# EAGLE design Legacy MkII (EAGLE 9.6.0)

## Sheet 1 of 3: Block Diagram
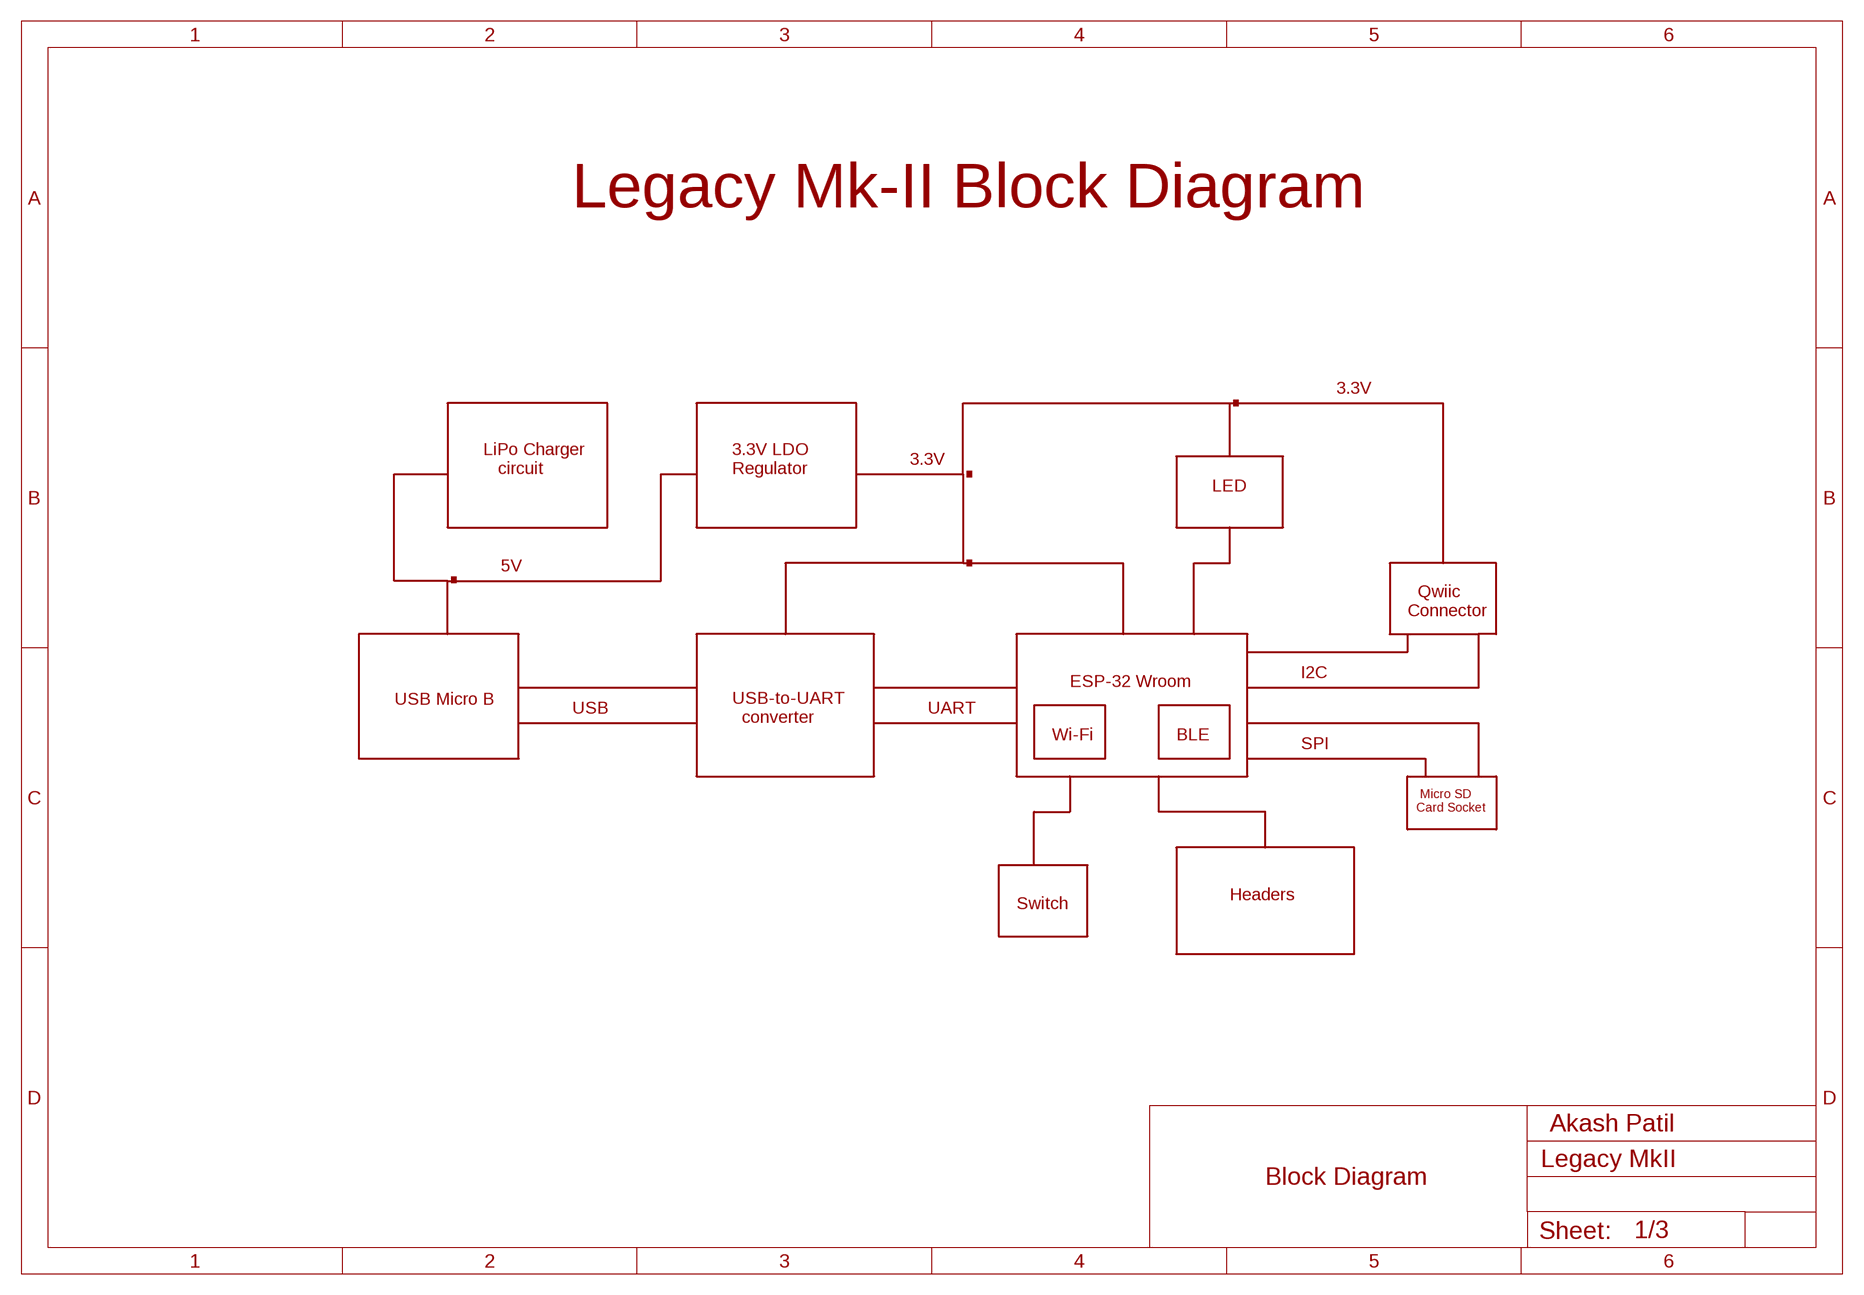
[diagram p0: schematic, sheet 1]

### Notes on the sheet
- Legacy Mk-II Block Diagram
- 3.3V
- .
- 3.3V
- LiPo Charger
     circuit
- 3.3V LDO
  Regulator
- .
- LED
- .
- 5V
- .
- Qwiic
  Connector
- I2C
- ESP-32 Wroom
- USB Micro B
- USB | UART
- USB-to-UART
    converter
- Wi-Fi | BLE
- SPI
- Micro SD 
  Card Socket
- Headers
- Switch
- Akash Patil
- Block Diagram

## Sheet 2 of 3: USB to UART converter, LDO regulator and Li-Po charger circuit.
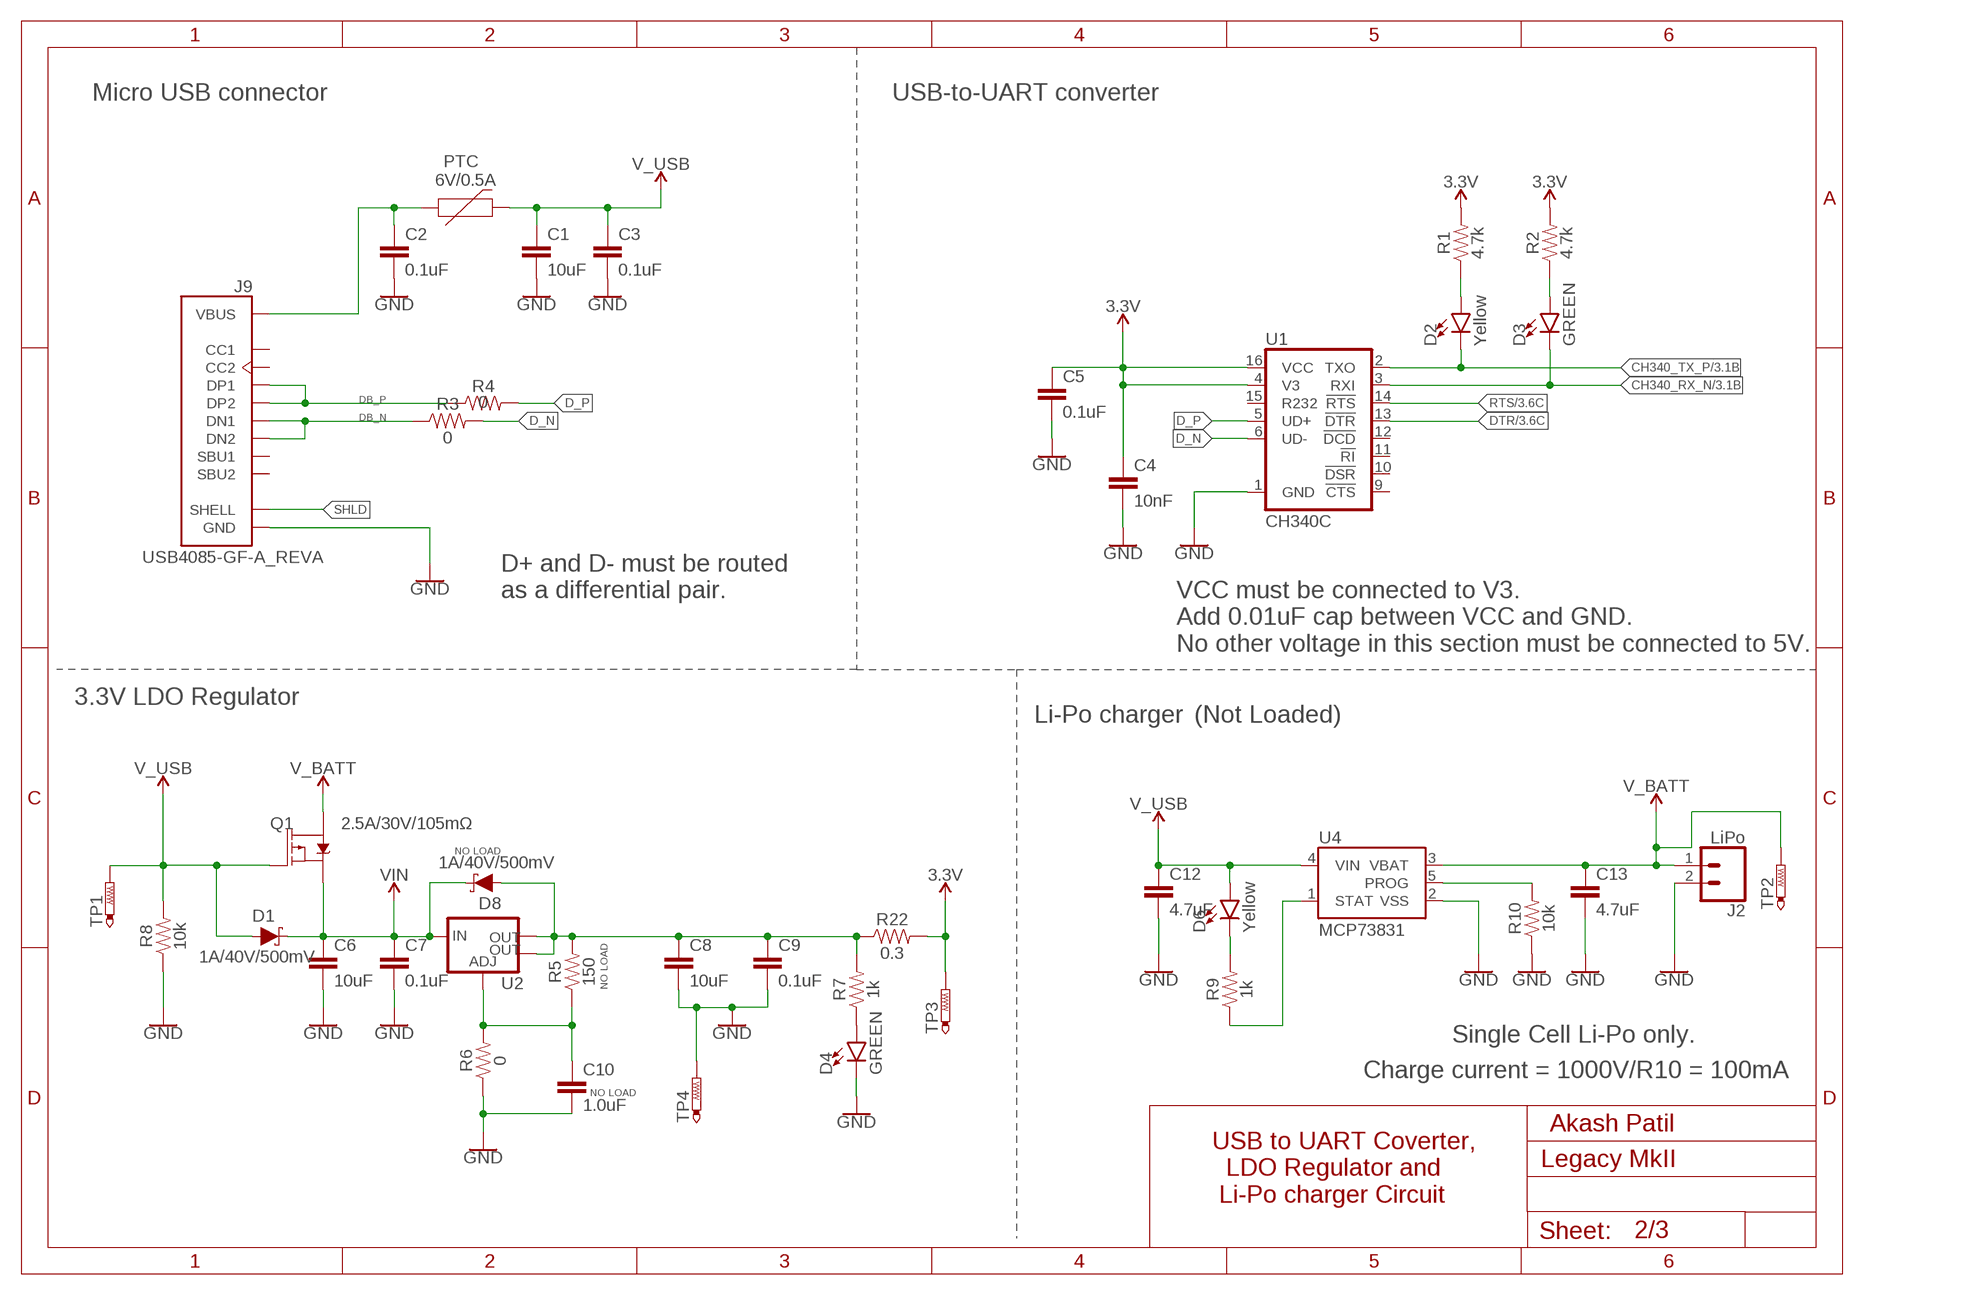
[diagram p1: schematic, sheet 2]

### Parts
C1  10uF  10UF-1210-50V-20%  [1210]
C2  0.1uF  0.1UF-0603-25V-(+80/-20%)  [0603]
C3  0.1uF  0.1UF-0603-25V-(+80/-20%)  [0603]
C4  10nF  10NF-0603-50V-10%  [0603]
C5  0.1uF  0.1UF-0603-25V-5%  [0603]
C6  10uF  10UF-1210-50V-20%  [1210]
C7  0.1uF  0.1UF-0603-25V-5%  [0603]
C8  10uF  10UF-1210-50V-20%  [1210]
C9  0.1uF  0.1UF-0603-25V-5%  [0603]
C10  1.0uF  1.0UF-0603-16V-10%  [0603]
C12  4.7uF  4.7UF-1206-16V-(+80/-20%)  [1206]
C13  4.7uF  4.7UF-1206-16V-(+80/-20%)  [1206]
D1  1A/40V/500mV  DIODE-SCHOTTKY-SS14  [SMA-DIODE]
D2  Yellow  LED-YELLOW0603  [LED-0603]
D3  GREEN  LED-GREEN0603  [LED-0603]
D4  GREEN  LED-GREEN0603  [LED-0603]
D6  Yellow  LED-YELLOW0603  [LED-0603]
D8  1A/40V/500mV  DIODE-SCHOTTKY-SS14  [SMA-DIODE]
J2  LiPo  CONN_02-JST-2-PTH-NO_SILK  [JST-2-PTH-NS]
J9  USB4085-GF-A_REVA  [GCT_USB4085-GF-A_REVA]
PTC  6V/0.5A  PPTC_6V500MA-2  [1206]
Q1  2.5A/30V/105mΩ  MOSFET_PCH-DMG2307L  [SOT23-3]
R1  4.7k  4.7KOHM-0603-1/10W-1%  [0603]
R2  4.7k  4.7KOHM-0603-1/10W-1%  [0603]
R3  0  0OHM-0603-1/10W-5%  [0603]
R4  0  0OHM-0603-1/10W-5%  [0603]
R5  150  150OHM-0603-1/10W-1%  [0603]
R6  0  0OHM-0603-1/10W-5%  [0603]
R7  1k  1KOHM-0603-1/10W-1%  [0603]
R8  10k  10KOHM-0603-1/10W-1%  [0603]
R9  1k  1KOHM-0603-1/10W-1%  [0603]
R10  10k  10KOHM-0603-1/10W-1%  [0603]
R22  0.3  0.3OHM-0805-1/8W-1%  [0805]
TP1  PTR1B1,27  [B1,27]
TP2  PTR1B1,27  [B1,27]
TP3  PTR1B1,27  [B1,27]
TP4  PTR1B1,27  [B1,27]
U1  CH340C  [SO016]
U2  V_REG_LM1117SOT223  [SOT223]
U4  MCP73831  [SOT23-5]

### Nets
3.3V: C4.1 C5.1 R1.2 R2.2 R22.2 TP3.TP U1.4(V3) U1.16(VCC) ; also sheet 3
CH340_RX_N: D3.C U1.3(RXI) ; also sheet 3
CH340_TX_P: D2.C U1.2(TXO) ; also sheet 3
D_N: R3.2 U1.6(UD-)
D_P: R4.2 U1.5(UD+)
DB_N: J9.A7(DN1) J9.B7(DN2) R3.1
DB_P: J9.A6(DP1) J9.B6(DP2) R4.1
DTR: U1.13(!DTR) ; also sheet 3
GND: C1.2 C2.2 C3.2 C4.2 C5.2 C6.2 C7.2 C8.2 C9.2 C10.2 C12.2 C13.2 D4.C J2.2 J9.A1(GND) J9.A12(GND) J9.B1(GND) J9.B12(GND) R6.1 R8.1 R10.1 TP4.TP U1.1(GND) U4.2(VSS) ; also sheet 3
N$1: C2.1 J9.A4(VBUS) J9.A9(VBUS) J9.B4(VBUS) J9.B9(VBUS) PTC.1
N$3: D4.A R7.1
N$4: C8.1 C9.1 D8.A R5.2 R7.2 R22.1 U2.2(OUT) U2.4(OUT)
N$5: D2.A R1.1
N$7: D3.A R2.1
N$11: C10.1 R5.1 R6.2 U2.1(ADJ)
N$12: D6.C R9.2
N$13: R9.1 U4.1(STAT)
N$15: R10.2 U4.5(PROG)
RTS: U1.14(!RTS) ; also sheet 3
SHLD: J9.P1(SHELL) J9.P2(SHELL) J9.P3(SHELL) J9.P4(SHELL)
V_BATT: C13.1 J2.1 Q1.3(D) TP2.TP U4.3(VBAT)
V_USB: C1.1 C3.1 C12.1 D1.A D6.A PTC.2 Q1.1(G) R8.2 TP1.TP U4.4(VIN) ; also sheet 3
VIN: C6.1 C7.1 D1.C D8.C Q1.2(S) U2.3(IN) ; also sheet 3
Unconnected: J9.A5(CC1) J9.A8(SBU1) J9.B5(CC2) J9.B8(SBU2) U1.9(!CTS) U1.10(!DSR) U1.11(!RI) U1.12(!DCD) U1.15(R232)

### Notes on the sheet
- Micro USB connector | USB-to-UART converter
- D+ and D- must be routed
  as a differential pair.
- VCC must be connected to V3. 
  Add 0.01uF cap between VCC and GND.
  No other voltage in this section must be connected to 5V.
- 3.3V LDO Regulator
- Li-Po charger | (Not Loaded)
- Single Cell Li-Po only.
- Charge current = 1000V/R10 = 100mA
- Akash Patil
- USB to UART Coverter,
    LDO Regulator and 
   Li-Po charger Circuit

## Sheet 3 of 3: ESP-32, Auto reset and switches circuit.
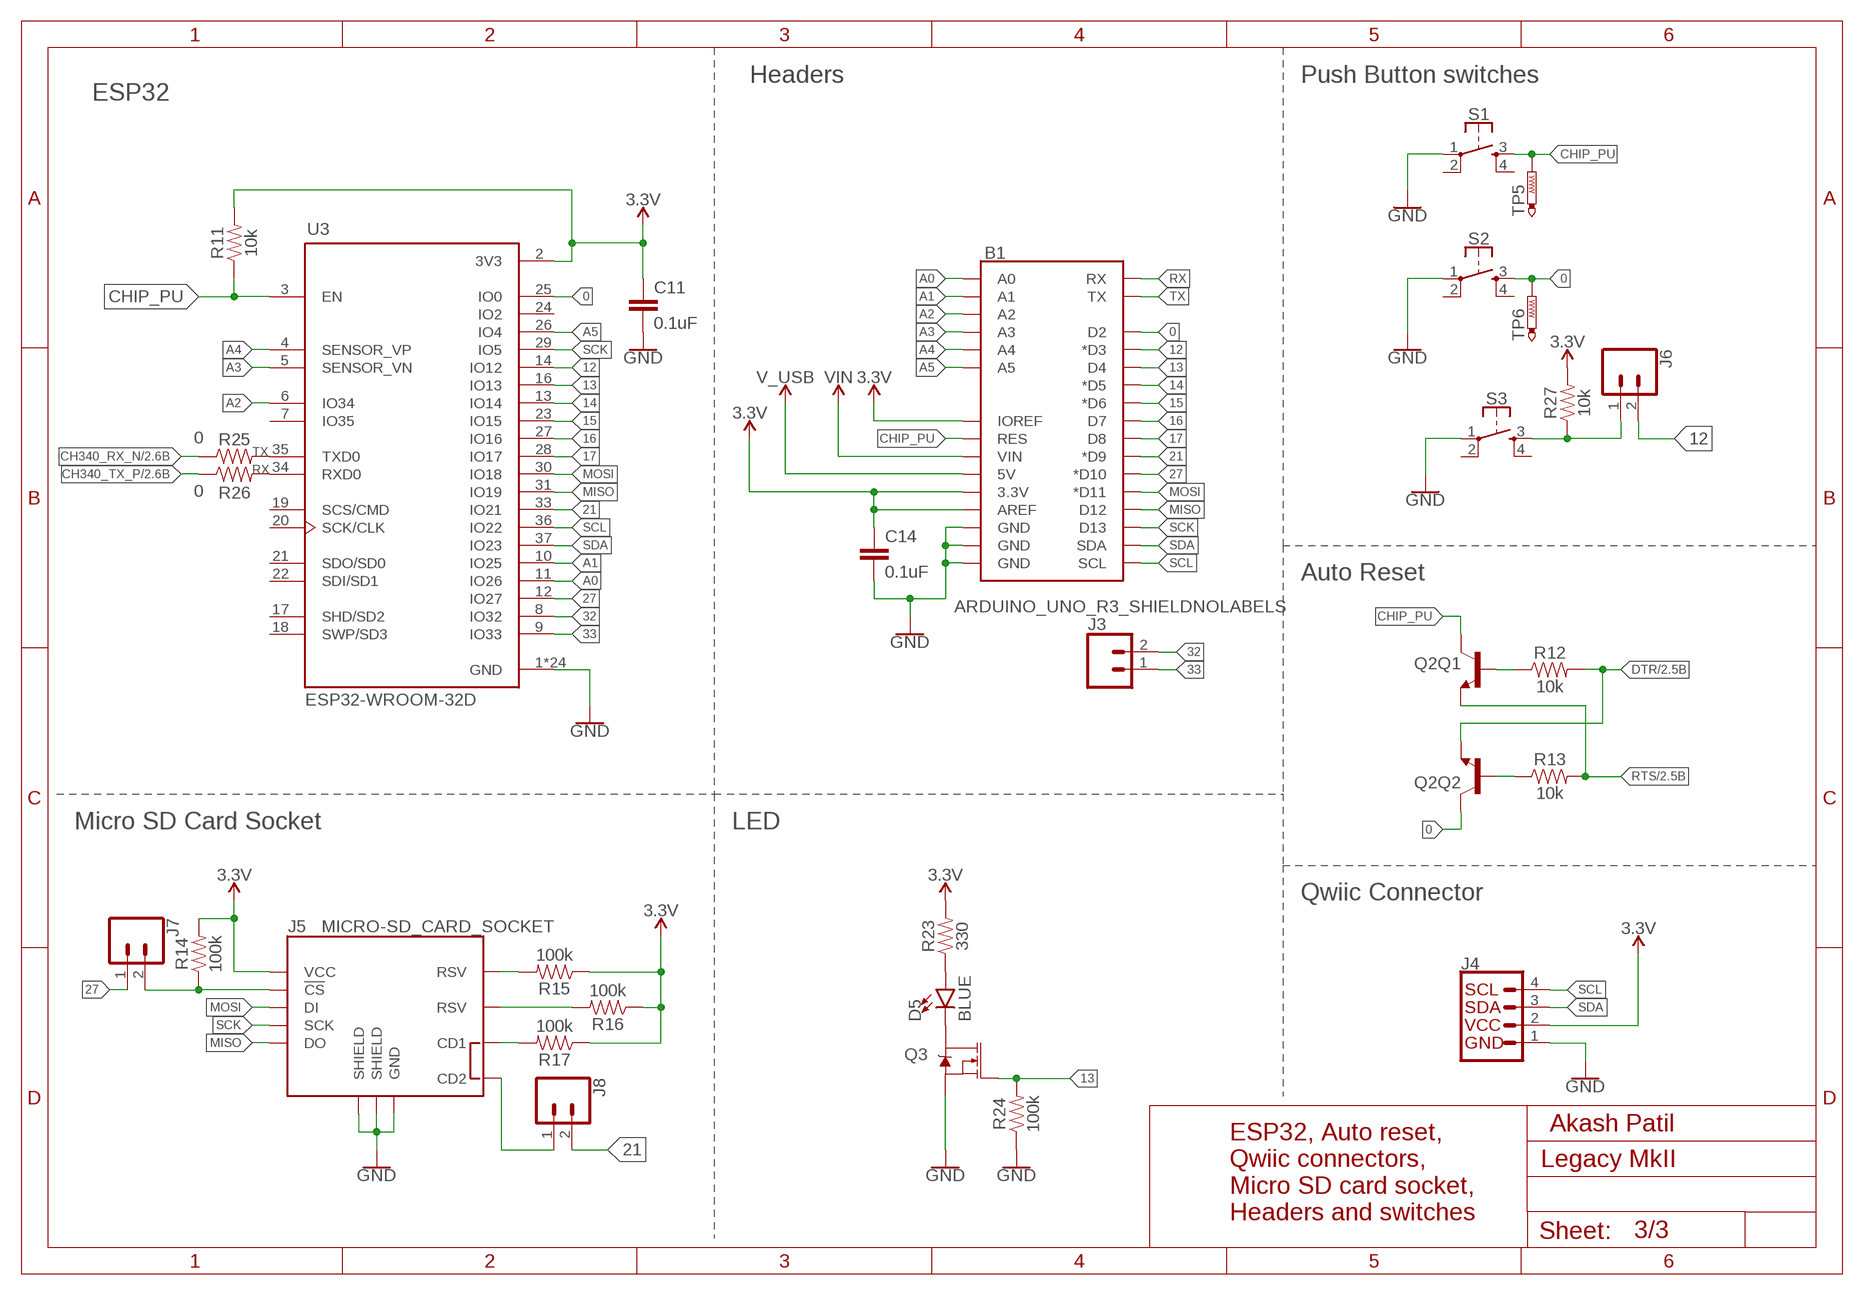
[diagram p2: schematic, sheet 3]

### Parts
B1  ARDUINO_UNO_R3_SHIELDNOLABELS  [UNO_R3_SHIELD_NOLABELS]
C11  0.1uF  0.1UF-0603-25V-5%  [0603]
C14  0.1uF  0.1UF-0603-25V-5%  [0603]
D5  BLUE  LED-BLUE0603  [LED-0603]
J3  CONN_021X02_NO_SILK  [1X02_NO_SILK]
J4  QWIIC_CONNECTORJS-1MM  [1X04_1MM_RA]
J5  MICRO-SD_CARD_SOCKET  [MICRO-SD-SOCKET]
J6  CONN_02  [1X02]
J7  CONN_02  [1X02]
J8  CONN_02  [1X02]
Q2  TRANS_NPN_DUAL-MBT3904DW1T1  [SC70-6]
Q3  220mA/50V/3.5Ω  MOSFET-NCH-BSS138  [SOT23-3]
R11  10k  10KOHM-0603-1/10W-1%  [0603]
R12  10k  10KOHM-0603-1/10W-1%  [0603]
R13  10k  10KOHM-0603-1/10W-1%  [0603]
R14  100k  100KOHM-0603-1/10W-1%  [0603]
R15  100k  100KOHM-0603-1/10W-1%  [0603]
R16  100k  100KOHM-0603-1/10W-1%  [0603]
R17  100k  100KOHM-0603-1/10W-1%  [0603]
R23  330  330OHM-0603-1/10W-1%  [0603]
R24  100k  100KOHM-0603-1/10W-1%  [0603]
R25  0  0OHM-0603-1/10W-5%  [0603]
R26  0  0OHM-0603-1/10W-5%  [0603]
R27  10k  10KOHM-0603-1/10W-1%  [0603]
S1  MOMENTARY-SWITCH-SPST-2-SMD-4.6X2.8MM  [TACTILE_SWITCH_SMD_4.6X2.8MM]
S2  MOMENTARY-SWITCH-SPST-2-SMD-4.6X2.8MM  [TACTILE_SWITCH_SMD_4.6X2.8MM]
S3  MOMENTARY-SWITCH-SPST-2-SMD-4.6X2.8MM  [TACTILE_SWITCH_SMD_4.6X2.8MM]
TP5  PTR1B1,27  [B1,27]
TP6  PTR1B1,27  [B1,27]
U3  ESP32-WROOM-32D  [MODULE_ESP32-WROOM-32D]

### Nets
0: B1.D2 Q2.6(Q2:C) S2.3 TP6.TP U3.25(IO0)
3.3V: B1.3.3V B1.AREF B1.IOREF C11.1 C14.1 J4.2(VCC) J5.VCC R11.2 R14.2 R15.1 R16.1 R17.1 R23.2 R27.2 U3.2(3V3) ; also sheet 2
12: B1.D3(*D3) J6.2 U3.14(IO12)
13: B1.D4 Q3.1(G) R24.2 U3.16(IO13)
14: B1.D5(*D5) U3.13(IO14)
15: B1.D6(*D6) U3.23(IO15)
16: B1.D7 U3.27(IO16)
17: B1.D8 U3.28(IO17)
21: B1.D9(*D9) J8.2 U3.33(IO21)
27: B1.D10(*D10) J7.1 U3.12(IO27)
32: J3.2 U3.8(IO32)
33: J3.1 U3.9(IO33)
A0: B1.A0 U3.11(IO26)
A1: B1.A1 U3.10(IO25)
A2: B1.A2 U3.6(IO34)
A3: B1.A3 U3.5(SENSOR_VN)
A4: B1.A4 U3.4(SENSOR_VP)
A5: B1.A5 U3.26(IO4)
CH340_RX_N: R25.1 ; also sheet 2
CH340_TX_P: R26.1 ; also sheet 2
CHIP_PU: B1.RES Q2.3(Q1:C) R11.1 S1.3 TP5.TP U3.3(EN)
DTR: Q2.1(Q2:E) R12.2 ; also sheet 2
GND: B1.GND@0(GND) B1.GND@1(GND) B1.GND@2(GND) C11.2 C14.2 J4.1(GND) J5.GND J5.GND1(SHIELD) J5.GND3(SHIELD) Q3.2(S) R24.1 S1.1 S2.1 S3.1 U3.1(GND) U3.15(GND) U3.38(GND) U3.39_1(GND) U3.39_2(GND) U3.39_3(GND) U3.39_4(GND) U3.39_5(GND) U3.39_6(GND) U3.39_7(GND) U3.39_8(GND) U3.39_9(GND) U3.39_10(GND) U3.39_11(GND) U3.39_12(GND) U3.39_13(GND) U3.39_14(GND) U3.39_15(GND) U3.39_16(GND) U3.39_17(GND) U3.39_18(GND) U3.39_19(GND) U3.39_20(GND) U3.39_21(GND) ; also sheet 2
MISO: B1.D12 J5.DO U3.31(IO19)
MOSI: B1.D11(*D11) J5.DI U3.30(IO18)
N$2: J5.CD2 J8.1
N$6: J5.CS(!CS) J7.2 R14.1
N$8: D5.A R23.1
N$14: Q2.5(Q1:B) R12.1
N$16: Q2.2(Q2:B) R13.1
N$19: J5.RSV1(RSV) R15.2
N$22: D5.C Q3.3(D)
N$23: J5.RSV2(RSV) R16.2
N$24: J5.CD1 R17.2
N$25: J6.1 R27.1 S3.3
RTS: Q2.4(Q1:E) R13.2 ; also sheet 2
RX: B1.RX R26.2 U3.34(RXD0)
SCK: B1.D13 J5.SCLK(SCK) U3.29(IO5)
SCL: B1.SCL J4.4(SCL) U3.36(IO22)
SDA: B1.SDA J4.3(SDA) U3.37(IO23)
TX: B1.TX R25.2 U3.35(TXD0)
V_USB: B1.5V ; also sheet 2
VIN: B1.VIN ; also sheet 2
Unconnected: S1.2 S1.4 S2.2 S2.4 S3.2 S3.4 U3.7(IO35) U3.17(SHD/SD2) U3.18(SWP/SD3) U3.19(SCS/CMD) U3.20(SCK/CLK) U3.21(SDO/SD0) U3.22(SDI/SD1) U3.24(IO2)

### Notes on the sheet
- Headers | Push Button switches
- ESP32
- Auto Reset
- Micro SD Card Socket | LED
- Qwiic Connector
- Akash Patil
- ESP32, Auto reset, 
  Qwiic connectors, 
  Micro SD card socket, 
  Headers and switches

## Library data of the parts
B1 = SparkFun-Boards:ARDUINO_UNO_R3_SHIELD: Arduino R3 Shield Footprint Shield form compatible with the Arduino Uno R3. SparkFun Products: MG2639 Cellular Shield <https://www.sparkfun.com/products/13120> MIDI Shield <https://www.sparkfun.com/products/12898> R3 Stackable Headers Kit <https://www.sparkfun.com/products/11417>
C1 C6 C8 = SparkFun-Capacitors:10UF: 10.0µF ceramic capacitors A capacitor is a passive two-terminal electrical component used to store electrical energy temporarily in an electric field.; PROD_ID: CAP-09824
C2 C3 = SparkFun-Capacitors:0.1UF: 0.1µF ceramic capacitors A capacitor is a passive two-terminal electrical component used to store electrical energy temporarily in an electric field.; PROD_ID: CAP-00810
C4 = SparkFun-Capacitors:10NF: 0.01uF/10nF/10,000pF ceramic capacitors A capacitor is a passive two-terminal electrical component used to store electrical energy temporarily in an electric field. CAP-09321; PROD_ID: CAP-00867
C5 C7 C9 C11 C14 = SparkFun-Capacitors:0.1UF: 0.1µF ceramic capacitors A capacitor is a passive two-terminal electrical component used to store electrical energy temporarily in an electric field.; PROD_ID: CAP-08604
C10 = SparkFun-Capacitors:1.0UF: 1µF ceramic capacitors A capacitor is a passive two-terminal electrical component used to store electrical energy temporarily in an electric field.; LOADING: NO LOAD; PROD_ID: CAP-00868
C12 C13 = SparkFun-Capacitors:4.7UF: 4.7µF ceramic capacitors A capacitor is a passive two-terminal electrical component used to store electrical energy temporarily in an electric field.; PROD_ID: CAP-10300
D1 = SparkFun-DiscreteSemi:DIODE-SCHOTTKY: Schottky diode A Schottky diode is a semiconductor diode which has a low forward voltage drop and a very fast switching action.; PROD_ID: DIO-08053
D2 D6 = SparkFun-LED:LED-YELLOW: Yellow SMD LED Used in manufacturing several products at SparkFun. Packages: 0603 - SMD 0603 package[Product Link] <http://www.kingbrightusa.com/product.asp?catalog_name=LED&product_id=APT1608SYCK> 0603 -SMART - SMART SMD 0603 package (more efficient/more expensive) [Product Link] <http://www.osram-os.com/osram_os/en/products/product-catalog/led-light-emitting-diodes/smartled-0603/ly-l29k/index.jsp> LilyPad - SMD1206 package[Product Datasheet] <https://www.sparkfun.com/datasheets/DevTools/LilyPad/Q150YUS4.pdf> SparkFun Products: Blynk Board <https://www.sparkfun.com/products/13794> IOIO-OTG <https://www.sparkfun.com/products/13613> XBee Explorer Serial <https://www.sparkfun.com/products/13225>; PROD_ID: DIO-09003
D3 D4 = SparkFun-LED:LED-GREEN: Green SMD LED Used in manufacturing of various products at SparkFun Packages: 0603 - SMD 0603 package [Product Link] <http://www.futureelectronics.com/en/technologies/semiconductors/optoelectronics/leds/Pages/9894312-LTST-C190GKT.aspx?CrossPart=HSMG-C190&IM=0> LilyPad 1206 - SMD1206 LilyPad package [Product Link] <http://www.futureelectronics.com/en/Technologies/Product.aspx?ProductID=IN150NGHARVATEKCORPORATION2049943&IM=0> 1206 - SMD1206 package [Product Link] <http://www.futureelectronics.com/en/technologies/semiconductors/optoelectronics/leds/Pages/8315665-LTST-C150KGKT.aspx?IM=0> 1206 Bottom Mount -SMD 1206 Bottom Mount [Product Link] <http://www.digikey.com/product-detail/en/lite-on-inc/LTST-C230KGKT/160-1456-1-ND/386854> SparkFun Products: Pro Mini 328 -5V <https://www.sparkfun.com/products/821> RedBoard <https://www.sparkfun.com/products/12757> MP3 Trigger <https://www.sparkfun.com/products/13720> Makey Makey <https://www.sparkfun.com/products/11076>; PROD_ID: DIO-00821
D5 = SparkFun-LED:LED-BLUE: Blue SMD LED Used in manufacturing of various products at SparkFun Packages: 0603 - SMD 0603 package [Product Link] <http://www.digikey.com/product-detail/en/SMLE12BC7TT86/511-1589-2-ND/1641808> 1206 - SMD1206 package [Product Link] <http://www.digikey.com/product-detail/en/lite-on-inc/LTST-C150TBKT/160-1643-1-ND/573584> SparkFun Products: ESP8266 Thing-Dev Board <https://www.sparkfun.com/products/13711> RedBoard <https://www.sparkfun.com/products/12757>; PROD_ID: DIO-08575
D8 = SparkFun-DiscreteSemi:DIODE-SCHOTTKY: Schottky diode A Schottky diode is a semiconductor diode which has a low forward voltage drop and a very fast switching action.; LOADING: NO LOAD; PROD_ID: DIO-08053
J2 J3 J6-J8 = SparkFun-Connectors:CONN_02: Multi connection point. Often used as Generic Header-pin footprint for 0.1 inch spaced/style header connections On any of the 0.1 inch spaced packages, you can populate with these: Break Away Headers - Straight <https://www.sparkfun.com/products/116> (PRT-00116) Break Away Male Headers - Right Angle <https://www.sparkfun.com/products/553> (PRT-00553) Female Headers <https://www.sparkfun.com/products/115> (PRT-00115) Break Away Headers - Machine Pin <https://www.sparkfun.com/products/117> (PRT-00117) Break Away Female Headers - Swiss Machine Pin <https://www.sparkfun.com/products/743> (PRT-00743) For SCREWTERMINALS and SPRING TERMINALS visit here: Screw Terimnals on SparkFun.com <https://www.sparkfun.com/search/results?term=Screw+Terminals> (5mm/3.5mm/2.54mm spacing) This device is also useful as a general connection point to wire up your design to another part of your project. Our various solder wires solder well into these plated through hole pads. Hook-Up Wire - Assortment (Stranded, 22 AWG) <https://www.sparkfun.com/products/11375> (PRT-11375) Hook-Up Wire - Assortment (Solid Core, 22 AWG) <https://www.sparkfun.com/products/11367> (PRT-11367) View the entire wire category on our website here <https://www.sparkfun.com/categories/141> Special notes: Molex polarized connector foot print use with: PRT-08233 with associated crimp pins and housings. 2.54_SCREWTERM for use with PRT-10571. 3.5mm Screw Terminal footprints for PRT-08084 5mm Screw Terminal footprints for use with PRT-08432
J4 = SparkFun-Connectors:QWIIC_CONNECTOR: SparkFun I2C Standard Qwiic Connector An SMD 1mm pitch JST connector makes it easy and quick (get it? Qwiic?) to connect I2C devices to each other. The Qwiic system <http://www.sparkfun.com/qwiic> enables fast and solderless connection between popular platforms and various sensors and actuators. We carry 200mm <https://www.sparkfun.com/products/14204>, 100mm <https://www.sparkfun.com/products/14205>, 50mm <https://www.sparkfun.com/products/14206>, and breadboard friendly <https://www.sparkfun.com/products/14207> Qwiic cables. We also offer 10 pcs strips <https://www.sparkfun.com/products/14323> the SMD connectors.
J5 = SparkFun-Connectors:MICRO-SD_CARD_SOCKET: microSD Socket for Transflash Push-push type µSD socket. tDoc lines correctly indicate media card edge positions when inserting (unlocked, locked, depressed). NOTE: CD1 and CD2 are connected internally, and the default detect state of the socket is detect pin to ground. SparkFun Products: WAV Trigger <https://www.sparkfun.com/products/13660> CAN-Bus Shield <https://www.sparkfun.com/products/13262> SparkFun Level Shifing microSD Breakout <https://www.sparkfun.com/products/13743>; PROD_ID: CONN-07820; SF_ID: PRT-00127
J9 = USB4085-GF-A_REVA:USB4085-GF-A_REVA: USB 2.0 Type C Receptacle Dip Type, PCB Top Mount Check prices <https://pricing.snapeda.com/parts/USB4085-GF-A/Global%20Connector%20Technology/view-part?ref=eda>; AVAILABILITY: Warning; DESCRIPTION: USB-C (USB TYPE-C) USB 2.0 Receptacle Connector 24 (16+8 Dummy) Position Through Hole, Right Angle; MF: Global Connector Technology; MP: USB4085-GF-A; PACKAGE: Package; PRICE: None; PURCHASE-URL: https://pricing.snapeda.com/search/part/USB4085-GF-A/?ref=eda
PTC = SparkFun-Fuses:PPTC: Resettable Fuse PPTC Resettable Fuse. Really a sort of resistor with a polymeric positive temperature coefficient whose resistance increases dramatically with an increase in temperature. When heated by the power passing through the resistance rises causing the current to be limited, protecting the circuit. This is achieved by the transition of the polymer from a crystalline to an amorphous state where the conductive carbon separates breaking the conductive pathways found in the cool crystalline structure. When a PPTC cools back down it resumes conducting letting the circuit turn back on. SparkFun Products: SparkFun RedBoard - Programmed with Arduino <https://www.sparkfun.com/products/12757> Pro Micro - 5V/16MHz <https://www.sparkfun.com/products/12640> Arduino Pro 328 - 5V/16MHz <https://www.sparkfun.com/products/10915> MP3 Trigger <https://www.sparkfun.com/products/13720>; PROD_ID: RES-08585
Q1 = SparkFun-DiscreteSemi:MOSFET_PCH: P-channel MOSFETs Voltage controlled devices that allow control of high current outputs. SparkFun Products: SparkFun ESP32 Thing <https://www.sparkfun.com/products/13907> SparkFun ESP8266 Thing <https://www.sparkfun.com/products/13231>; PROD_ID: TRANS-11308
Q2 = SparkFun-DiscreteSemi:TRANS_NPN_DUAL: Dual NPN Transistors in Single Package The MBT3904W1 puts two general purpose 3904 NPN transistors in a single package. Datasheet <http://www.onsemi.com/pub_link/Collateral/MBT3904DW1T1-D.PDF> SparkFun Products: SparkFun ESP32 Thing <https://www.sparkfun.com/products/13907>; PROD_ID: TRANS-13337
Q3 = SparkFun-DiscreteSemi:MOSFET-NCH: N-channel MOSFETs Voltage controlled devices that allow control of high current outputs. SparkFun Products: SparkFun OpenScale <https://www.sparkfun.com/products/13261> SparkFun Digital Sandbox <https://www.sparkfun.com/products/12651> SparkFun Monster Moto Shield <https://www.sparkfun.com/products/10182> SparkFun MOSFET Power Controller <https://www.sparkfun.com/products/11214>; PROD_ID: TRANS-00830
R1 R2 = SparkFun-Resistors:4.7KOHM: 4.7kΩ resistor A resistor is a passive two-terminal electrical component that implements electrical resistance as a circuit element. Resistors act to reduce current flow, and, at the same time, act to lower voltage levels within circuits. - Wikipedia; PROD_ID: RES-07857
R3 R4 R6 R25 R26 = SparkFun-Resistors:0OHM: 0Ω resistor A resistor is a passive two-terminal electrical component that implements electrical resistance as a circuit element. Resistors act to reduce current flow, and, at the same time, act to lower voltage levels within circuits. - Wikipedia; PROD_ID: RES-08609
R5 = SparkFun-Resistors:150OHM: 150Ω resistor A resistor is a passive two-terminal electrical component that implements electrical resistance as a circuit element. Resistors act to reduce current flow, and, at the same time, act to lower voltage levels within circuits. - Wikipedia; LOADING: NO LOAD; PROD_ID: RES-11028
R7 R9 = SparkFun-Resistors:1KOHM: 1kΩ resistor A resistor is a passive two-terminal electrical component that implements electrical resistance as a circuit element. Resistors act to reduce current flow, and, at the same time, act to lower voltage levels within circuits. - Wikipedia; PROD_ID: RES-07856
R8 R10-R13 R27 = SparkFun-Resistors:10KOHM: 10kΩ resistor A resistor is a passive two-terminal electrical component that implements electrical resistance as a circuit element. Resistors act to reduce current flow, and, at the same time, act to lower voltage levels within circuits. - Wikipedia; PROD_ID: RES-00824
R14-R17 R24 = SparkFun-Resistors:100KOHM: 100kΩ resistor A resistor is a passive two-terminal electrical component that implements electrical resistance as a circuit element. Resistors act to reduce current flow, and, at the same time, act to lower voltage levels within circuits. - Wikipedia; PROD_ID: RES-07828
R22 = SparkFun-Resistors:0.3OHM: 0.3Ω resistor A resistor is a passive two-terminal electrical component that implements electrical resistance as a circuit element. Resistors act to reduce current flow, and, at the same time, act to lower voltage levels within circuits. - Wikipedia; PROD_ID: RES-11622
R23 = SparkFun-Resistors:330OHM: 330Ω resistor A resistor is a passive two-terminal electrical component that implements electrical resistance as a circuit element. Resistors act to reduce current flow, and, at the same time, act to lower voltage levels within circuits. - Wikipedia; PROD_ID: RES-00818
S1-S3 = SparkFun-Switches:MOMENTARY-SWITCH-SPST-2: Momentary Switch (Pushbutton) - SPST - Two Circuits Normally-open (NO) SPST momentary switches (buttons, pushbuttons). Schematic symbol includes two switch circuits. Variants SMD-4.6MMX2.8MM - 4.60mm x 2.80mm Tactile Momentary Button Switch - Used on SparkFun SAMD21 Mini Breakout <https://www.sparkfun.com/products/13664> SMD-5.2MM - Mini Pushbutton Switch - SMD <https://www.sparkfun.com/products/8720> - Used on Arduino Pro Mini <https://www.sparkfun.com/products/11114>; PROD_ID: SWCH-13065
TP1-TP6 = testpad:PTR1: TEST PIN
U1 = SparkFun-IC-Comms:CH340C; PROD_ID: IC-14038
U2 = SparkFun-IC-Power:V_REG_LM1117: Voltage Regulator LM1117 Standard adjustable voltage regulator but in SMD form. Spark Fun Electronics SKU : COM-00595; PROD_ID: VREG-08170
U3 = ESP32-WROOM-32D:ESP32-WROOM-32D: Bluetooth, WiFi 802.11b/g/n, Bluetooth v4.2 + EDR, Class 1, 2 and 3 Transceiver Module 2.4GHz ~ 2.5GHz Integrated, Trace Surface Mount Check prices <https://pricing.snapeda.com/parts/ESP32-WROOM-32D/Espressif%20Systems/view-part?ref=eda>; AVAILABILITY: Bad; DESCRIPTION: Bluetooth, WiFi 802.11b/g/n, Bluetooth v4.2 +EDR, Class 1, 2 and 3 Transceiver Module 2.4GHz ~ 2.5GHz Integrated, Trace Surface Mount; MF: Espressif Systems; MP: ESP32-WROOM-32D; PACKAGE: Module Espressif Systems; PRICE: None
U4 = SparkFun-IC-Power:MCP73831: MCP73831T Li-Ion, Li-Pol Controller Miniature single cell, fully integrated Li-Ion, Li-polymer charge management controller Datasheet <http://ww1.microchip.com/downloads/en/DeviceDoc/20001984g.pdf> SparkFun Products: SparkFun ESP32 Thing <https://www.sparkfun.com/products/13907> SparkFun 9DoF Razor IMU M0 <https://www.sparkfun.com/products/14001>; PROD_ID: IC-09995

## Board
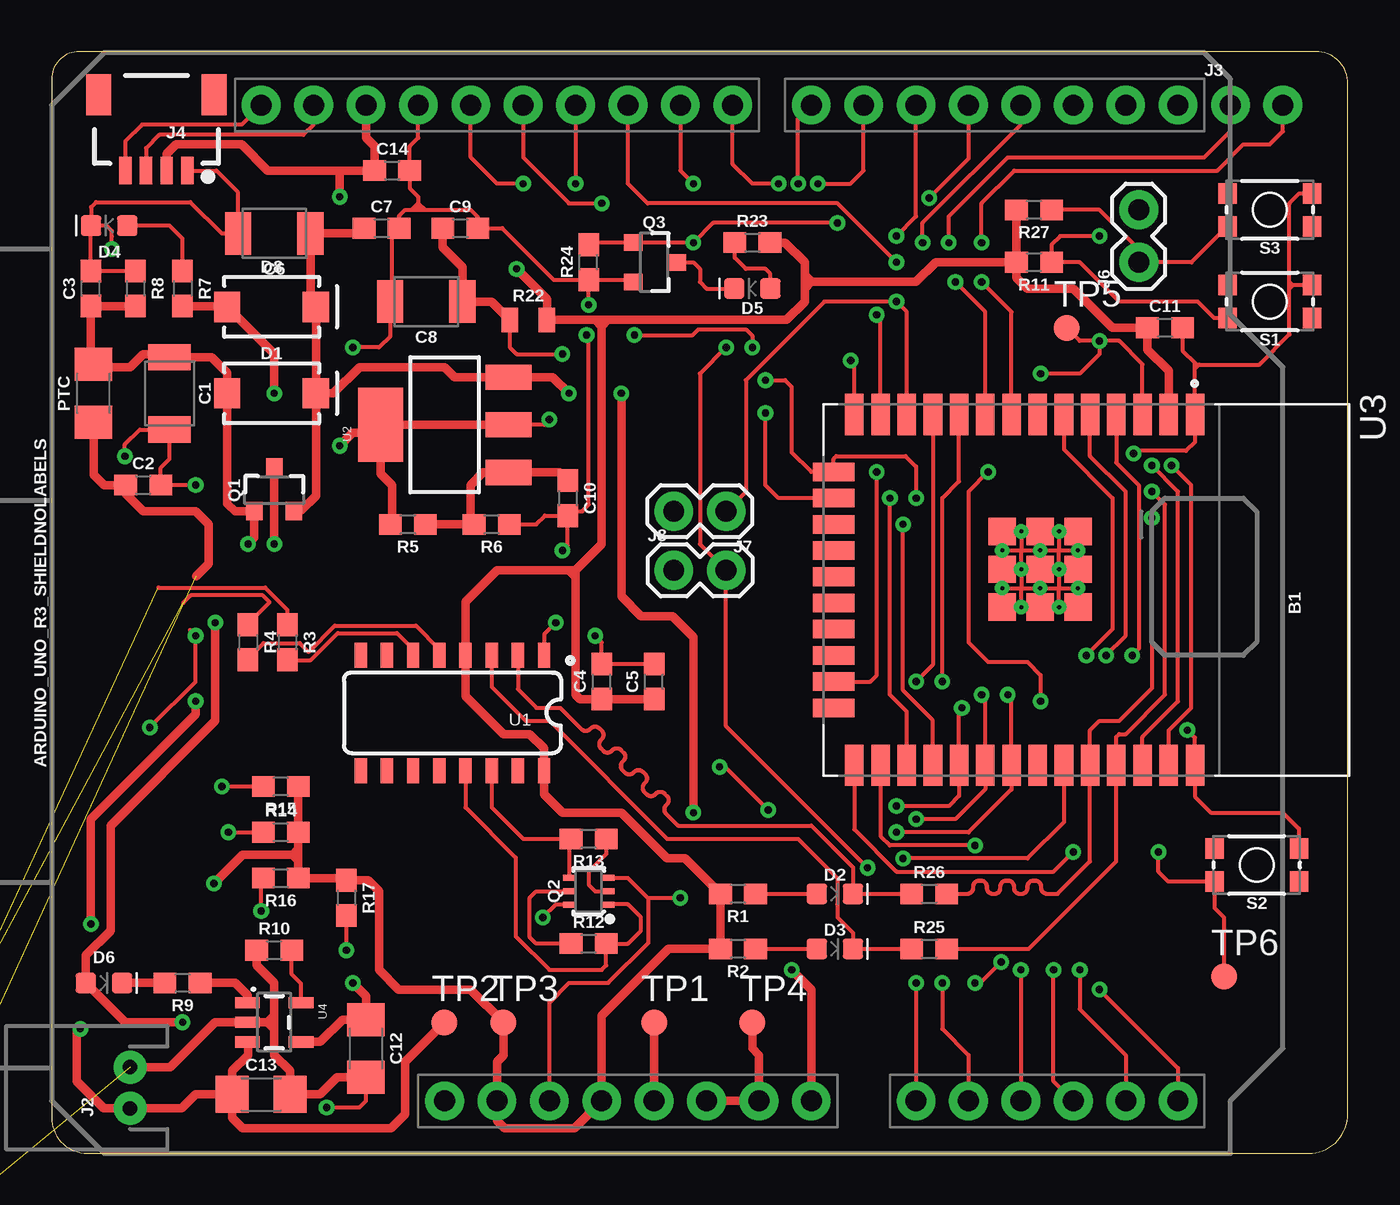
[diagram p3: board, top side]
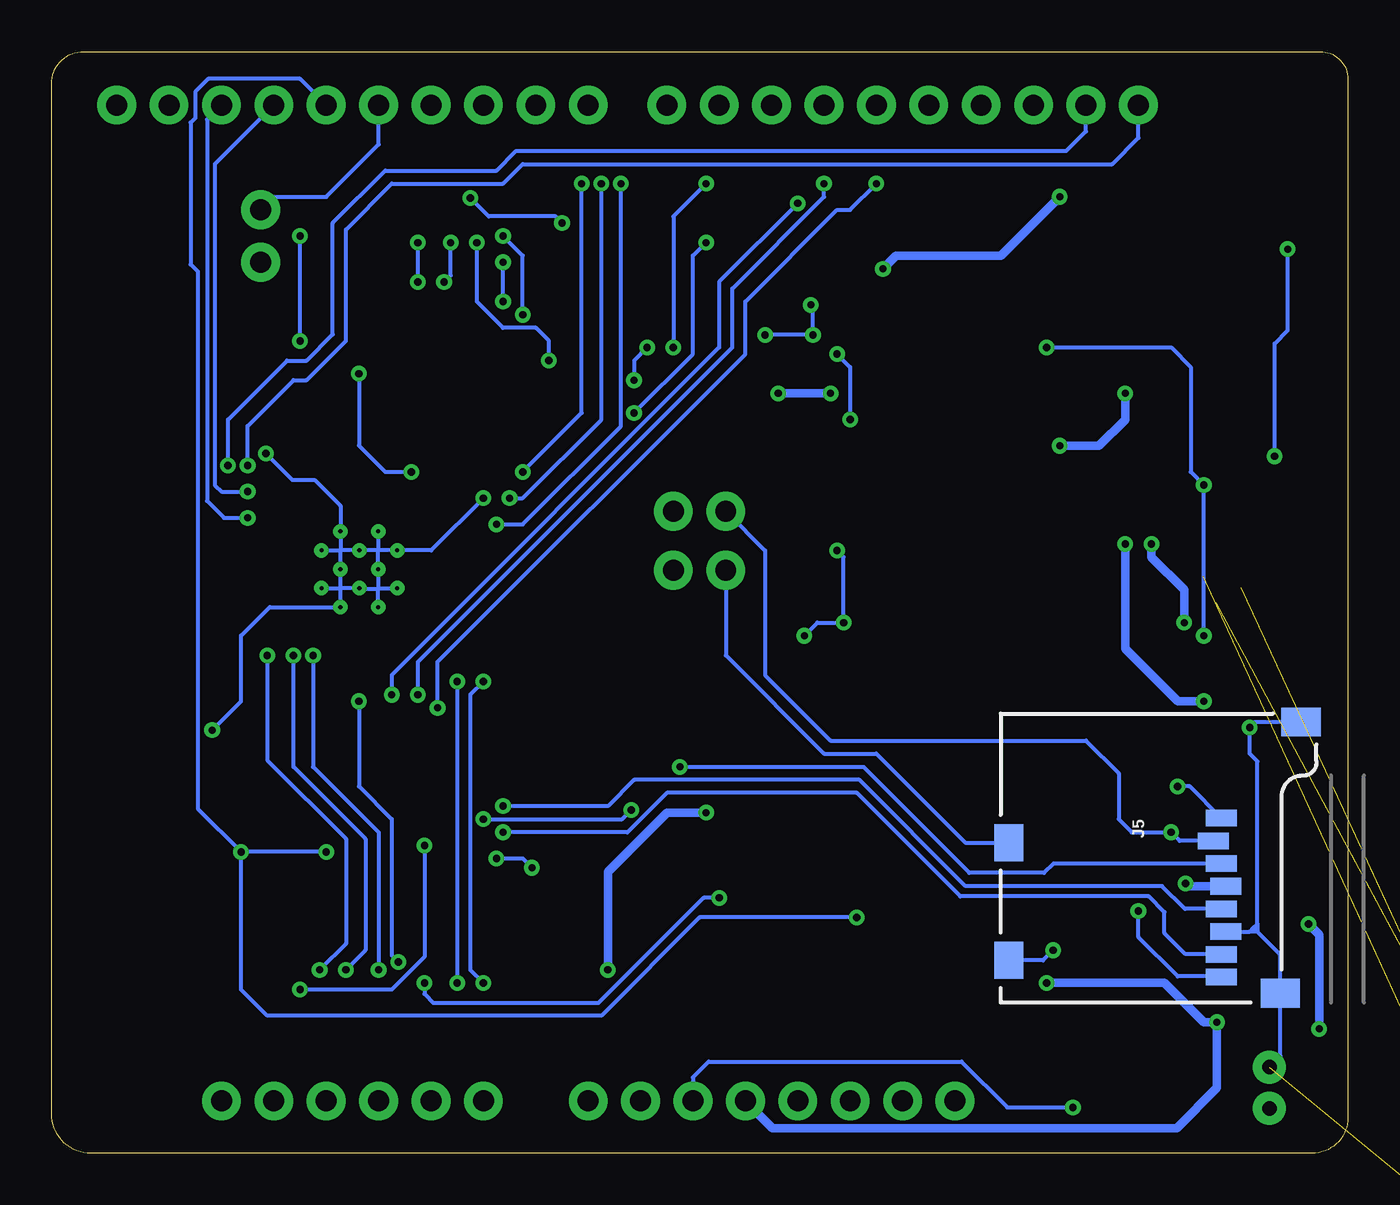
[diagram p4: board, bottom side, seen from below]

Size 62.84 x 53.39 mm. Coordinates in mm from the lower left corner, seen from the top.
Outline: 61.29,53.39 1.35,53.39 arc90 0,52.05 0,1.73 arc90 1.73,0 60.93,0 arc90 62.84,1.91 62.84,51.84 arc90 61.29,53.39
Copper layers (1*16): Top 0.035mm / dielectric 1.5mm / Bottom 0.035mm
Design rules "default *": minimum track width 6mil, minimum drill 0.35mm, track to track 6mil, track to pad 6mil, pad to pad 6mil, via to via 6mil, smd to smd 6mil, copper to edge 40mil, drill to drill 6mil, minimum pad ring 10mil, minimum via ring 8mil, stop-mask expansion 4mil, vias tented up to drill 15mil, thermal gap 10mil

### Footprints (pad centres in the part's own frame; a part is rotated, then mirrored left to right if it is on the bottom)
UNO_R3_SHIELD_NOLABELS = drill 1.016 pad 1.88: 3.3V 24.13,-3.81; 5V 24.13,-1.27; A0 24.13,11.43; A1 24.13,13.97; A2 24.13,16.51; A3 24.13,19.05; A4 24.13,21.59; A5 24.13,24.13; AREF -24.13,-15.24; D2 -24.13,19.05; D3 -24.13,16.51; D4 -24.13,13.97; D5 -24.13,11.43; D6 -24.13,8.89; D7 -24.13,6.35; D8 -24.13,2.54; D9 -24.13,0; D10 -24.13,-2.54; D11 -24.13,-5.08; D12 -24.13,-7.62; D13 -24.13,-10.16; GND@0 24.13,1.27; GND@1 24.13,3.81; GND@2 -24.13,-12.7; IOREF 24.13,-8.89; NC 24.13,-11.43; RES 24.13,-6.35; RX -24.13,24.13; SCL -24.13,-20.32; SDA -24.13,-17.78; TX -24.13,21.59; VIN 24.13,6.35
1210 = smd 1.27 x 2.06: 1 -1.755,0; 2 1.755,0
0603 = smd 1.1 x 1: 1 -0.85,0; 2 0.85,0
1206 = smd 1.6 x 1.8: 1 -1.4,0; 2 1.4,0
SMA-DIODE = smd 1.27 x 1.47: A -2.15,0; C 2.15,0
LED-0603 = smd 1 x 1: A -0.877,0; C 0.877,0
JST-2-PTH-NS = drill 0.7 pad 1.6: 1 -1,0; 2 1,0
1X02_NO_SILK = drill 1.016 pad 1.88: 1 0,0; 2 2.54,0
1X04_1MM_RA = smd 0.6 x 1.35: 1 -1.5,0; 2 -0.5,0; 3 0.5,0; 4 1.5,0 | smd 1.2 x 2: NC1 2.8,-3.675; NC2 -2.8,-3.675
MICRO-SD-SOCKET = smd 1.8 x 1.4: CD1 -2.05,0.4; CD2 -7.75,0.4 | smd 0.8 x 1.5: CS -7.84,10.3; DI -6.74,10.7; DO -2.34,10.7; GND -3.44,10.9; RSV1 -8.94,10.7; RSV2 -1.24,10.7; SCLK -4.54,10.7; VCC -5.64,10.9 | smd 1.4 x 1.9: GND1 -13.6,14.55; GND3 -0.45,13.55
1X02 = drill 1.016 pad 1.88: 1 0,0; 2 2.54,0
GCT_USB4085-GF-A_REVA = drill 0.4 pad 0.65: A1 -2.975,4.025; A4 -2.125,4.025; A5 -1.275,4.025; A6 -0.425,4.025; A7 0.425,4.025; A8 1.275,4.025; A9 2.125,4.025; A12 2.975,4.025; B1 2.975,2.675; B4 2.125,2.675; B5 1.275,2.675; B6 0.425,2.675; B7 -0.425,2.675; B8 -1.275,2.675; B9 -2.125,2.675; B12 -2.975,2.675 | drill 0.6 long: P1 -4.325,3.045; P2 4.325,3.045; P3 4.325,-0.335; P4 -4.325,-0.335
SOT23-3 = smd 0.8 x 0.9: 1 -0.95,-1; 2 0.95,-1; 3 0,1.1
SC70-6 = smd 0.3 x 0.66: 1 -0.65,-0.92; 2 0,-0.92; 3 0.65,-0.92; 4 0.65,0.92; 5 0,0.92; 6 -0.65,0.92
0805 = smd 0.8 x 1.2: 1 -0.9,0; 2 0.9,0
TACTILE_SWITCH_SMD_4.6X2.8MM = smd 0.9 x 1: 1 -2.05,-0.8; 2 2.05,-0.8; 3 2.05,0.8; 4 -2.05,0.8
B1,27 = smd 1.27 x 1.27: TP 0,0
SO016 = smd 0.6 x 1.2: 1 -4.445,-2.8; 2 -3.175,-2.8; 3 -1.905,-2.8; 4 -0.635,-2.8; 5 0.635,-2.8; 6 1.905,-2.8; 7 3.175,-2.8; 8 4.445,-2.8; 9 4.445,2.8; 10 3.175,2.8; 11 1.905,2.8; 12 0.635,2.8; 13 -0.635,2.8; 14 -1.905,2.8; 15 -3.175,2.8; 16 -4.445,2.8
SOT223 = smd 1.219 x 2.235: 1 -2.311,-3.099; 2 0,-3.099; 3 2.311,-3.099 | smd 3.6 x 2.2: 4 0,3.099
MODULE_ESP32-WROOM-32D = smd 2 x 0.9: 1 -8.5,5.26; 2 -8.5,3.99; 3 -8.5,2.72; 4 -8.5,1.45; 5 -8.5,0.18; 6 -8.5,-1.09; 7 -8.5,-2.36; 8 -8.5,-3.63; 9 -8.5,-4.9; 10 -8.5,-6.17; 11 -8.5,-7.44; 12 -8.5,-8.71; 13 -8.5,-9.98; 14 -8.5,-11.25; 25 8.5,-11.25; 26 8.5,-9.98; 27 8.5,-8.71; 28 8.5,-7.44; 29 8.5,-6.17; 30 8.5,-4.9; 31 8.5,-3.63; 32 8.5,-2.36; 33 8.5,-1.09; 34 8.5,0.18; 35 8.5,1.45; 36 8.5,2.72; 37 8.5,3.99; 38 8.5,5.26 | smd 0.9 x 2: 15 -5.715,-12.25; 16 -4.445,-12.25; 17 -3.175,-12.25; 18 -1.905,-12.25; 19 -0.635,-12.25; 20 0.635,-12.25; 21 1.905,-12.25; 22 3.175,-12.25; 23 4.445,-12.25; 24 5.715,-12.25 | smd 1.33 x 1.33: 39_1 -2.835,-0.405; 39_2 -1,-0.405; 39_3 0.835,-0.405; 39_4 -2.835,-2.24; 39_5 -1,-2.24; 39_6 0.835,-2.24; 39_7 -2.835,-4.075; 39_8 -1,-4.075; 39_9 0.835,-4.075 | drill 0.2 pad 0.3: 39_10 -1.917,-0.405; 39_11 -0.083,-0.405; 39_12 -2.835,-1.323; 39_13 -1,-1.323; 39_14 0.835,-1.323; 39_15 -1.917,-2.24; 39_16 -0.083,-2.24; 39_17 -2.835,-3.158; 39_18 -1,-3.158; 39_19 0.835,-3.158; 39_20 -1.917,-4.075; 39_21 -0.083,-4.075
SOT23-5 = smd 0.55 x 1.2: 1 -0.95,-1.3; 2 0,-1.3; 3 0.95,-1.3; 4 0.95,1.3; 5 -0.95,1.3

### Placement (x,y rotation side)
B1  30.48,26.67 270 top
C1  5.71,36.83 270 top
C2  4.45,32.38 0 top
C3  1.91,41.91 90 top
C4  26.67,22.86 90 top
C5  29.21,22.86 90 top
C6  10.79,44.58 180 top
C7  16,44.83 0 top
C8  18.16,41.27 180 top
C9  19.81,44.83 0 top
C10  25.02,31.75 270 top
C11  53.98,40.01 0 top
C12  15.24,5.08 270 top
C13  10.16,2.86 0 top
C14  16.51,47.62 0 top
D1  10.67,36.83 0 top
D2  37.97,12.57 0 top
D3  37.97,9.91 0 top
D4  2.79,44.96 180 top
D5  33.97,41.91 180 top
D6  2.54,8.26 0 top
D8  10.67,41.02 0 top
J2  3.81,3.17 90 top
J3  57.15,50.8 0 top
J4  5.08,47.62 180 top
J5  16.83,7.3 270 bottom
J6  52.7,43.18 90 top
J7  32.7,31.11 180 top
J8  30.16,28.26 0 top
J9  -10.16,-8.89 0 top  (outside the outline)
PTC  2.03,36.83 90 top
Q1  10.79,32.13 0 top
Q2  26.04,12.7 90 top
Q3  29.21,43.18 270 top
R1  33.27,12.57 180 top
R2  33.27,9.91 180 top
R3  11.43,24.77 270 top
R4  9.53,24.77 270 top
R5  17.27,30.48 180 top
R6  21.34,30.48 180 top
R7  6.35,41.91 270 top
R8  4.06,41.91 270 top
R9  6.35,8.26 180 top
R10  10.79,9.84 0 top
R11  47.62,43.18 180 top
R12  26.04,10.16 0 top
R13  26.04,15.24 180 top
R14  11.11,15.56 0 top
R15  11.11,17.78 180 top
R16  11.11,13.34 180 top
R17  14.29,12.38 270 top
R22  23.11,40.39 0 top
R23  33.97,44.13 0 top
R24  26.04,43.18 90 top
R25  42.55,9.91 0 top
R26  42.55,12.57 0 top
R27  47.62,45.72 180 top
S1  59.05,41.27 180 top
S2  58.42,13.97 180 top
S3  59.05,45.72 180 top
TP1  29.21,6.35 0 top
TP2  19.05,6.35 0 top
TP3  21.91,6.35 0 top
TP4  33.97,6.35 0 top
TP5  49.21,40.01 0 top
TP6  56.83,8.57 0 top
U1  19.43,21.34 180 top
U2  19.05,35.31 90 top
U3  50.16,27.3 270 top
U4  10.79,6.35 270 top

### Tracks (layer width: path | path; a pad name or v marks a point on that pad's centre or on a via)
0  (via drill 0.35)
  Top 0.203: TP6.TP 56.83,11.43 56.37,11.89 S2.3 54.14,13.17 53.66,13.65 v53.66,14.61 | U3.25 38.91,15.7 40.96,13.65 48.58,13.65 v49.53,14.61 | Q2.6 24.43,12.05 v23.81,11.43
  Bottom 0.203: v23.81,11.43 31.43,11.43 36.2,6.67 52.39,6.67 53.66,7.94 v53.66,14.61 | B1.D2 50.8,52.07 55.24,52.07 55.88,51.44 55.88,50.16 56.1,49.94 56.1,43.09 55.75,42.74 55.75,16.7 v53.66,14.61 | v49.53,14.61 v53.66,14.61
3.3V  (via drill 0.35)
  Top 0.406: U3.2 54.16,37.92 53.12,38.95 C11.1 51.44,40.01 49.53,41.91 47.31,41.91 46.77,42.44 R11.2 | R11.2 R27.2 | 26.35,40.39 R22.2 24.01,41.39 v22.54,42.86 | 26.35,40.39 26.67,40.39 | 26.67,40.39 26.99,40.39 | 26.99,40.39 35.62,40.39 36.51,41.27 36.51,41.91 | R23.2 35.56,44.13 36.51,43.18 36.51,42.55 | 36.51,41.91 36.51,42.23 | 36.51,42.23 36.51,42.55 | 36.51,42.23 36.83,42.23 | 36.51,42.55 36.83,42.23 | 36.83,42.23 36.51,41.91 | C5.1 C4.1 25.61,22.01 25.4,22.23 25.4,27.94 | 25.4,28.26 26.67,29.53 26.67,40.07 | 26.67,40.07 26.67,40.39 | 25.08,28.26 21.59,28.26 20.07,26.73 U1.4 20.07,22.16 21.91,20.32 23.18,20.32 23.88,19.62 U1.16 23.88,17.4 24.77,16.51 27.62,16.51 29.84,14.29 30.71,14.29 R1.2 R2.2 29.91,9.91 26.67,6.67 B1.3.3V 25.35,1.22 21.96,1.22 21.59,1.59 B1.IOREF 21.59,4.45 21.91,4.76 TP3.TP 20.32,7.94 16.83,7.94 15.88,8.89 15.88,12.7 15.34,13.23 R17.1 14.19,13.34 R16.1 11.96,14.22 | 25.08,28.26 25.4,28.26 | 26.35,40.39 26.67,40.07 | 26.67,40.07 26.99,40.39 | 25.4,27.94 25.4,28.26 | 25.4,27.94 25.08,28.26 | 11.96,14.73 R14.2 R15.1 | 11.96,14.73 11.96,14.48 | 11.96,14.48 11.96,14.22 | 36.83,42.23 41.91,42.23 42.86,43.18 R11.2 | B1.AREF 15.24,49.21 15.66,48.79 C14.1 13.97,47.62 | 13.97,47.62 10.48,47.62 9.21,48.9 6.03,48.9 5.58,48.44 J4.2 | v7.87,13.08 9.27,14.48 11.68,14.48 | 11.96,14.48 11.68,14.48 | 11.68,14.48 11.94,14.73 11.96,14.73 | 11.68,14.48 11.94,14.22 11.96,14.22 | 13.97,47.62 v13.97,46.35
  Bottom 0.406: J5.VCC 7.74,12.94 v7.87,13.08 | v13.97,46.35 16.83,43.5 21.91,43.5 v22.54,42.86
12  (via drill 0.35)
  Top 0.203: U3.14 38.91,38.24 v38.73,38.42 | v42.23,44.13 42.23,45.09 46.99,49.85 B1.D3
  Bottom 0.203: v38.73,38.42 38.73,39.37 39.37,40.01 40.96,40.01 42.23,41.27 v42.23,44.13 | J6.2 52.07,46.35 49.53,46.35 46.99,48.9 B1.D3
13  (via drill 0.35)
  Top 0.203: R24.2 26.14,44.13 Q3.1 v31.11,44.13 32.07,45.09 v38.1,45.09 | U3.16 35.24,31.75 34.61,32.38 v34.61,35.88 | B1.D4 44.45,48.2 v42.54,46.29
  Bottom 0.203: v31.11,44.13 31.75,43.5 31.75,38.73 v34.61,35.88 | v38.1,45.09 38.42,45.4 41.65,45.4 v42.54,46.29
14  (via drill 0.35)
  Top 0.203: U3.13 40.19,40.46 v40.01,40.64 | v40.96,44.45 41.91,45.4 B1.D5
  Bottom 0.203: v40.01,40.64 40.01,43.5 v40.96,44.45
15  (via drill 0.35)
  Top 0.203: U3.23 39.69,22.86 40.01,23.18 v40.01,33.02 | v37.15,46.99 38.73,46.99 39.37,47.62 B1.D6
  Bottom 0.203: v40.01,33.02 37.15,35.88 v37.15,46.99
16  (via drill 0.35)
  Top 0.203: U3.27 41.45,21.41 40.64,22.23 v40.64,31.75 | v36.2,46.99 36.2,50.16 B1.D7
  Bottom 0.203: v40.64,31.75 40.01,31.75 36.2,35.56 v36.2,46.99
17  (via drill 0.35)
  Top 0.203: U3.28 42.73,20.98 41.27,22.43 v41.27,30.48 | v35.24,46.99 33.97,46.99 33.02,47.94 B1.D8
  Bottom 0.203: v41.27,30.48 40.01,30.48 35.24,35.24 v35.24,46.99
21  (via drill 0.35)
  Top 0.203: B1.D9 30.48,47.62 v31.11,46.99 | v32.7,39.05 31.43,37.78 31.43,29.53 J8.2 32.7,20.7 v39.56,13.84 | U3.33 49.08,16.05 47.31,14.29 v41.27,14.29
  Bottom 0.203: v31.11,46.99 32.7,45.4 v32.7,39.05 | v41.27,14.29 40.01,14.29 v39.56,13.84
27  (via drill 0.35)
  Top 0.203: U3.12 41.45,40.78 v40.96,41.27 37.47,41.27 33.66,37.47 33.66,32.07 J7.1 | B1.D10 27.94,46.99 28.89,46.04 38.1,46.04 v40.96,43.18
  Bottom 0.203: v40.96,41.27 v40.96,43.18
32  (via drill 0.35)
  Top 0.203: U3.8 46.53,40.78 v45.09,42.23 | v45.09,44.13 45.09,46.04 46.67,47.62 56.52,47.62 57.78,48.9 59.05,48.9 59.69,49.53 J3.2
  Bottom 0.203: v45.09,42.23 v45.09,44.13
33  (via drill 0.35)
  Top 0.203: U3.9 45.27,40.78 v43.81,42.23 | v43.5,44.13 43.5,45.4 46.35,48.26 55.88,48.26 57.15,49.53 J3.1
  Bottom 0.203: v43.81,42.23 43.5,42.55 v43.5,44.13
A0  (via drill 0.35)
  Top 0.203: U3.11 42.73,23.68 v41.91,22.86 | v41.91,8.26 B1.A0
  Bottom 0.203: v41.91,8.26 42.55,8.89 42.55,22.23 v41.91,22.86
A1  (via drill 0.35)
  Top 0.203: v43.18,8.26 43.18,6.03 44.45,4.76 B1.A1 | U3.10 43.99,32.56 43.18,31.75 v43.18,22.86
  Bottom 0.203: v43.18,22.86 v43.18,8.26
A2  (via drill 0.35)
  Top 0.203: U3.6 49.08,34.11 51.44,31.75 51.44,25.4 v50.16,24.13 | v46.99,8.89 B1.A2
  Bottom 0.203: v50.16,24.13 50.16,18.73 46.99,15.56 v46.99,8.89
A3  (via drill 0.35)
  Top 0.203: B1.A3 48.58,3.49 v48.58,8.89 | v51.12,24.13 52.07,25.08 52.07,32.07 50.34,33.79 U3.5
  Bottom 0.203: v48.58,8.89 47.62,9.84 47.62,15.24 51.12,18.73 v51.12,24.13
A4  (via drill 0.35)
  Top 0.203: U3.4 51.62,33.48 52.7,32.38 52.7,24.45 v52.39,24.13 | v49.85,8.89 49.85,6.99 52.07,4.76 B1.A4
  Bottom 0.203: v52.39,24.13 52.39,19.05 48.58,15.24 48.58,10.16 v49.85,8.89
A5  (via drill 0.35)
  Top 0.203: U3.26 40.19,15.38 40.64,14.92 v44.77,14.92 | v50.8,7.94 54.61,4.13 B1.A5
  Bottom 0.203: v44.77,14.92 44.77,9.53 46.35,7.94 v50.8,7.94
CH340_RX_N
  Top 0.203: U1.3 21.34,22.6 22.98,20.95 24.13,20.95 29.84,15.24 36.2,15.24 38.1,13.34 38.1,12.06 38.1,12.05 38.1,11.43 38.85,10.68 D3.C R25.1
CH340_TX_P
  Top 0.203: U1.2 22.61,22.5 23.51,21.59 24.66,21.59 25.69,20.56 arc90 26.1,20.56 26.14,20.6 arc-90 26.55,20.6 26.67,20.48 arc-90 26.67,20.07 26.63,20.03 arc90 26.63,19.62 26.74,19.5 arc90 27.16,19.5 27.2,19.55 arc-90 27.61,19.55 27.72,19.43 arc-90 27.72,19.02 27.68,18.98 arc90 27.68,18.56 27.8,18.45 arc90 28.21,18.45 28.25,18.49 arc-90 28.66,18.49 28.78,18.38 arc-90 28.78,17.96 28.74,17.92 arc90 28.74,17.51 28.85,17.4 arc90 29.26,17.4 29.3,17.44 arc-90 29.72,17.44 29.83,17.32 arc-90 29.83,16.91 29.79,16.87 arc90 29.79,16.46 30.37,15.88 36.83,15.88 38.85,13.86 D2.C R26.1
CHIP_PU  (via drill 0.35)
  Top 0.203: S1.3 56.36,40.48 55.56,41.27 51.75,41.27 49.85,43.18 R11.1 48.48,44.03 48.9,44.45 v50.8,44.45 | U3.3 52.88,38.24 51.75,39.37 v50.8,39.37 | Q2.3 26.97,13.34 27.94,13.34 28.93,12.34 | 28.93,12.34 28.93,10.2 26.99,8.26 25.08,8.26 24.13,7.3 B1.RES | v50.8,39.37 49.85,39.37 TP5.TP | 28.93,12.34 28.97,12.38 v30.48,12.38 | v50.8,39.37 50.8,38.73 49.85,37.78 v47.94,37.78 | v45.4,33.02 44.45,32.07 44.45,24.77 45.4,23.81 47.31,23.81 47.94,23.18 v47.94,21.91 | v46.04,9.27 45.02,8.26 v44.77,8.26
  Bottom 0.203: v50.8,39.37 v50.8,44.45 | v30.48,12.38 31.24,12.38 36.34,7.28 44.32,7.28 44.77,7.72 v44.77,8.26 | v47.94,37.78 47.94,34.29 46.67,33.02 v45.4,33.02 | v47.94,21.91 47.94,17.78 46.35,16.19 46.35,9.59 v46.04,9.27
D_N
  Top 0.203: U1.6 17.53,24.44 16.75,25.21 13.87,25.21 12.57,23.91 R3.2
D_P
  Top 0.203: U1.5 18.8,24.44 17.66,25.57 13.73,25.57 12.47,24.32 12.44,24.32 12.04,24.72 10.28,24.72 9.53,23.96 R4.2
DB_N  (2 unrouted)
  Top 0.203: R3.1 11.43,26.34 10.36,27.42 5.18,27.42
DB_P  (2 unrouted)
  Top 0.203: R4.1 9.53,25.66 10.56,26.7 10.21,27.06 6.78,27.06 6.39,26.67
DTR
  Top 0.203: Q2.1 26.97,12.06 27.94,12.06 28.57,11.43 28.57,10.79 27.94,10.16 R12.2 26.89,9.11 26.67,8.89 24.13,8.89 22.5,10.52 22.5,14.33 20.07,16.76 U1.13
GND  (via drill 0.35)  (4 unrouted)
  Top 0.203: R8.1 C3.2 1.91,44.95 D4.C | 17.46,45.72 17.14,45.72 16.85,45.43 C7.2 16.51,44.49 16.51,41.38 C8.2 16.41,39.58 15.88,39.05 v14.61,39.05 | 17.46,45.72 17.78,45.72 | 17.78,45.72 18.1,45.72 | 18.1,45.72 20.32,45.72 20.66,45.38 C9.2 21.84,44.83 24.34,42.33 R24.1 | 17.78,45.72 17.78,46.04 | 17.78,46.04 17.78,46.35 17.36,46.77 C14.2 17.36,48.79 17.78,49.21 B1.GND@2 | 17.78,46.04 17.46,45.72 | 17.78,46.04 18.1,45.72 | R24.1 28.11,42.33 Q3.2 | S3.1 60.49,46.52 60.01,46.04 60.01,42.23 | 60.01,41.91 60.01,39.69 58.55,38.23 55.63,38.23 | 60.01,41.91 60.01,42.23 | 60.01,42.23 60.16,42.08 | S1.1 60.16,42.08 | 60.16,42.08 60.16,42.06 60.01,41.91 | v4.76,20.64 6.99,22.86 v6.99,25.08 6.7,25.37 | R6.1 23.5,30.48 23.91,30.9 C10.2 | C5.2 C4.2 26.67,24.77 v26.35,25.08 | C10.2 25.23,31.11 25.72,31.11 26.04,31.43 26.04,39.55 v25.94,39.65 | v26.04,41.12 R24.1 | U1.1 23.88,25.15 v24.45,25.72 | v24.77,29.21 25.02,29.46 C10.2 | v6.99,32.38 C2.2 5.29,33.23 5.71,33.66 C1.2 4.28,35.08 3.56,34.35 v3.56,33.78 | S2.1 60.47,15.73 59.69,16.51 56.2,16.51 55.42,17.28 U3.38 55.42,20.14 v55.06,20.51 | U3.39_8 U3.39_9 U3.39_6 U3.39_3 49.76,27.3 | 49.76,27.3 U3.39_2 U3.39_10 | U3.39_7 U3.39_4 U3.39_1 U3.39_10 | U3.39_10 49.75,29.22 48.83,29.22 | 49.76,27.3 49.68,27.39 48.83,27.39 | v52.45,33.91 52.58,34.04 54.99,34.04 55.42,34.47 U3.1 55.42,38.03 | v41.91,31.75 41.91,33.27 41.4,33.78 38.04,33.78 37.91,33.66 U3.15 36.83,33.02 35.88,33.97 35.88,37.15 35.56,37.47 v34.61,37.47 | C11.2 54.83,38.9 55.42,38.3 | 55.42,38.3 55.5,38.23 55.63,38.23 | 55.42,38.03 55.42,38.3 | 55.42,38.03 55.63,38.23 | v13.34,2.22 14.92,2.22 15.24,2.54 C12.2
  Top 0.203: v28.26,39.65 31.08,39.65 31.36,39.93 33.66,39.93 33.97,39.61 v33.97,39.05 | U3.39_21 46.99,27.39 | 46.99,27.39 U3.39_16 | U3.39_19 47.01,27.37 46.99,27.39 | 46.99,27.39 47.01,27.41 U3.39_18 47.01,29.18 47.05,29.22 | U3.39_16 48.83,27.39 | U3.39_14 48.84,27.38 48.83,27.39 | 48.83,27.39 48.84,27.4 U3.39_13 48.84,29.21 48.83,29.22 | U3.39_20 47.05,29.22 | 47.05,29.22 U3.39_15 48.83,29.22 | U3.39_12 48.84,29.23 48.83,29.22 | U3.39_17 47.01,29.27 47.05,29.22 | U3.39_16 U3.39_5 | D4.C 1.92,45.86 2.16,46.1 6.73,46.1 8.26,44.58 9.02,44.58 | 9.02,44.58 C6.2 | v2.92,43.81 2.92,44.44 2.92,44.71 2.67,44.96 D4.C | J4.1 8,47.62 9.02,46.61 9.02,44.58
  Top 0.406: J2.2 5.76,4.17 7.94,6.35 U4.2 10.48,6.35 | 10.79,6.03 10.48,6.35 | 10.79,6.03 10.79,4.76 11.56,4 C13.2 13.02,2.86 13.84,3.68 C12.2 | R10.1 9.95,9.11 10.79,8.26 10.79,6.67 | 10.79,6.03 10.79,6.67 | 10.48,6.35 10.79,6.67 | B1.GND@0 B1.GND@1 34.29,4.76 33.97,5.08 TP4.TP
  Bottom 0.203: J5.GND1 4.5,20.9 v4.76,20.64 4.76,19.37 4.39,19 4.39,11.11 | J5.GND 4.76,10.74 | 4.39,10.74 4.76,10.74 | 4.39,10.74 3.28,9.63 J5.GND3 3.28,4.71 J2.2 | v25.94,39.65 25.94,39.69 | 25.94,39.69 25.94,41.02 v26.04,41.12 | v26.35,25.08 25.72,25.72 v24.45,25.72 24.45,28.89 v24.77,29.21 | v6.99,25.08 v6.99,32.38 7.62,33.02 7.62,38.1 8.57,39.05 v14.61,39.05 | 4.39,11.11 4.39,10.74 | 4.76,10.74 4.58,10.93 | 4.58,10.93 4.39,11.11 | 4.39,10.74 4.58,10.93 | v52.45,33.91 51.18,32.64 50.1,32.64 48.84,31.38 U3.39_12 48.84,29.21 | v3.56,33.78 3.56,39.24 2.92,39.88 v2.92,43.81 | v13.34,2.22 16.51,2.22 18.73,4.45 30.99,4.45 31.75,3.68 B1.GND@0 | v55.06,20.51 53.66,21.91 53.66,25.08 52.27,26.47 U3.39_14 48.84,27.38 48.83,27.39 | v28.26,39.65 28.22,39.69 25.94,39.69 | v41.91,31.75 44.44,29.22 U3.39_20 46.99,29.22 | v33.97,39.05 34.61,38.42 v34.61,37.47 | U3.39_10 49.76,29.27 49.7,29.21 48.84,29.21 | U3.39_19 47.01,27.39 U3.39_21 | 48.83,27.39 U3.39_16 47.91,27.37 47.01,27.37 U3.39_18 47.01,29.2 46.99,29.22 | U3.39_11 48.83,27.39 | 48.83,27.39 U3.39_13 48.84,29.21 | 46.99,29.22 U3.39_15 48.83,29.22 48.84,29.21 | U3.39_17 47.01,29.24 46.99,29.22
MISO  (via drill 0.35)
  Top 0.203: v46.35,22.23 46.53,22.05 U3.31 46.53,17.64 44.45,15.56 v40.96,15.56 | B1.D12 22.86,48.26 25.08,46.04 v26.67,46.04
  Bottom 0.203: v26.67,46.04 30.48,42.23 30.48,39.05 46.35,23.18 v46.35,22.23 | J5.DO 6.14,9.65 7.87,9.65 8.89,10.67 8.89,11.68 9.65,12.45 18.8,12.45 23.81,17.46 33.02,17.46 34.92,15.56 v40.96,15.56
MOSI  (via drill 0.35)
  Top 0.203: v45.09,22.23 45.27,22.05 U3.30 45.27,17.64 43.81,16.19 v41.91,16.19 | B1.D11 v25.4,46.99 | v34.74,16.64 32.65,18.73 v32.38,18.73
  Bottom 0.203: v25.4,46.99 25.4,46.35 29.84,41.91 29.84,39.05 45.09,23.81 v45.09,22.23 | J5.DI 14.28,14.04 14.73,13.59 18.35,13.59 23.5,18.73 31.43,18.73 v32.38,18.73 | v41.91,16.19 35.18,16.19 v34.74,16.64
N$1  (4 unrouted)
  Top 0.406: 7.01,27.97 7.62,28.57 7.62,30.48 6.99,31.11 4.45,31.11 3.6,31.96 C2.1 2.54,32.38 2.03,32.89 PTC.1
N$2
  Bottom 0.203: J8.1 30.16,24.13 25.4,19.37 22.86,19.37 18.55,15.05 J5.CD2
N$3
  Top 0.203: R7.1 6.35,44.32 5.71,44.96 D4.A
N$4  (via drill 0.35)
  Top 0.203: R22.1 22.21,39.06 22.54,38.73 v24.77,38.73 | v24.13,35.56 23.88,35.31 U2.2
  Top 0.406: R7.2 8.48,41.06 D8.A 10.79,38.74 v10.79,36.83 | R22.1 21.32,41.27 C8.1 19.92,42.95 18.96,43.9 C9.1 | 15.95,34.92 U2.4 U2.2 | 15.95,34.92 15.95,32.94 16.51,32.38 16.51,30.57 R5.2 | v13.97,34.29 14.61,34.92 15.95,34.92
  Bottom 0.203: v24.77,38.73 24.13,38.1 v24.13,35.56
  Bottom 0.406: v10.79,36.83 10.79,35.56 12.06,34.29 v13.97,34.29
N$5
  Top 0.203: R1.1 D2.A
N$6  (via drill 0.35)
  Top 0.203: v8.57,15.56 R14.1
  Bottom 0.203: J5.CS 8.16,15.14 v8.57,15.56 10.48,15.56 11.11,16.19 11.11,18.41 12.7,20 25.08,20 28.26,23.18 28.26,29.21 J7.2
N$7
  Top 0.203: R2.1 D3.A
N$8
  Top 0.203: D5.A 34.85,42.62 34.61,42.86 33.66,42.86 33.12,43.4 R23.1
N$11
  Top 0.406: R5.1 R6.2 20.32,30.65 20.32,32.38 20.93,32.99 U2.1 24.62,32.99 C10.1
N$12
  Top 0.406: R9.2 D6.C
N$13
  Top 0.406: U4.1 9.49,7.65 8.89,8.26 R9.1
N$14
  Top 0.203: R12.1 23.5,10.16 23.18,10.48 23.18,12.38 23.5,12.7 Q2.5
N$15
  Top 0.203: U4.5 12.1,8.22 11.64,8.68 R10.2
N$16
  Top 0.203: R13.1 26.89,14.5 26.04,13.65 26.04,13.02 26.35,12.7 Q2.2
N$19  (via drill 0.35)
  Top 0.203: v8.26,17.78 R15.2
  Bottom 0.203: J5.RSV1 7.67,17.78 v8.26,17.78
N$22
  Top 0.203: Q3.3 31.11,43.18 31.43,42.86 31.43,42.23 31.75,41.91 D5.C
N$23  (via drill 0.35)
  Top 0.203: v10.16,11.75 10.16,13.23 R16.2
  Bottom 0.203: J5.RSV2 6.16,8.57 8.26,8.57 10.16,10.48 v10.16,11.75
N$24  (via drill 0.35)
  Top 0.203: R17.2 v14.29,9.84
  Bottom 0.203: v14.29,9.84 14.78,9.35 J5.CD1
N$25
  Top 0.203: S3.3 55.27,43.18 J6.1 52.7,43.81 50.8,45.72 R27.1
RTS
  Top 0.203: U1.14 21.34,16.76 22.86,15.24 R13.2 25.11,15.17 Q2.4
RX  (via drill 0.35)
  Top 0.203: R26.2 44.39,12.57 arc90 44.68,12.87 44.68,12.93 arc-90 44.97,13.22 45.05,13.22 arc-90 45.34,12.93 45.34,12.87 arc90 45.63,12.57 45.7,12.57 arc90 46,12.87 46,12.93 arc-90 46.29,13.22 46.36,13.22 arc-90 46.65,12.93 46.65,12.87 arc90 46.95,12.57 47.02,12.57 arc90 47.31,12.87 47.31,12.93 arc-90 47.6,13.22 47.68,13.22 arc-90 47.97,12.93 47.97,12.87 arc90 48.26,12.57 48.77,12.57 50.34,14.15 U3.34 50.34,20.5 50.8,20.95 51.75,20.95 53.34,22.54 v53.34,30.8
  Bottom 0.203: B1.RX 55.31,50.1 55.31,31.62 54.48,30.8 v53.34,30.8
SCK  (via drill 0.35)
  Top 0.203: v44.13,21.59 43.99,21.45 U3.29 43.99,17.32 43.5,16.83 v40.96,16.83 | v22.86,46.99 21.59,46.99 20.32,48.26 B1.D13
  Bottom 0.203: v44.13,21.59 44.13,23.81 29.21,38.73 29.21,41.27 24.77,45.72 24.13,45.72 v22.86,46.99 | J5.SCLK 7.91,11.84 9.02,12.95 18.54,12.95 23.68,18.1 34.61,18.1 35.88,16.83 v40.96,16.83
SCL  (via drill 0.35)
  Top 0.203: U3.36 52.88,20.18 54.61,21.91 54.61,32.07 v53.34,33.34 | B1.SCL 9.21,49.85 4.38,49.85 3.58,49.05 J4.4
  Bottom 0.203: v53.34,33.34 53.34,35.24 51.12,37.47 50.48,37.47 48.58,39.37 48.58,44.77 46.35,46.99 40.96,46.99 40.01,47.94 11.43,47.94 10.16,49.21 B1.SCL
SDA  (via drill 0.35)
  Top 0.203: U3.37 54.16,20.5 55.24,21.59 55.24,32.38 v54.29,33.34 | B1.SDA 12.7,49.85 12.21,49.35 5.22,49.35 4.58,48.71 J4.3
  Bottom 0.203: v54.29,33.34 54.29,35.56 51.44,38.42 50.48,38.42 49.21,39.69 49.21,45.09 46.67,47.62 41.27,47.62 40.32,48.58 13.65,48.58 12.7,49.53 B1.SDA
SHLD  (3 unrouted)
TX  (via drill 0.35)
  Top 0.203: R25.2 47.37,9.91 51.62,14.15 U3.35 51.62,20.18 51.75,20.32 52.07,20.32 53.98,22.23 53.98,31.43 v53.34,32.07
  Bottom 0.203: B1.TX 54.93,47.94 54.93,32.38 54.61,32.07 v53.34,32.07
V_BATT  (via drill 0.35)
  Top 0.406: U4.3 9.53,5.37 9.53,4.76 8.76,4 C13.1 | C13.1 6.99,2.86 6.3,2.17 J2.1 2.54,2.17 1.22,3.49 1.22,5.86 v1.39,6.03 | v10.79,29.53 Q1.3 | TP2.TP 17.14,4.45 17.14,1.91 16.46,1.22 9.26,1.22 8.76,1.72 C13.1 | v1.91,11.11 1.91,16.19 6.99,21.27 v6.99,21.91
  Bottom 0.406: v1.39,6.03 1.39,10.6 v1.91,11.11 | v6.99,21.91 8.26,21.91 10.79,24.45 v10.79,29.53
V_USB  (via drill 0.35)
  Top 0.305: 1.91,38.36 PTC.2 2.16,38.1 | C1.1 5.57,38.73
  Top 0.406: 1.91,38.36 C3.1 R8.2 | 5.57,38.73 4.45,38.73 3.81,38.1 2.16,38.1 | C1.1 7.77,38.59 8.52,37.84 D1.A 8.52,31.49 8.89,31.11 9.83,31.11 | Q1.1 9.83,31.11 | U4.4 13.02,5.4 14.1,6.48 C12.1 15.24,7.62 v14.61,8.26 | v9.53,29.53 9.83,29.83 9.83,31.11 | B1.5V TP1.TP | v6.35,6.35 3.57,6.35 D6.A 1.66,9.6 2.86,10.79 2.86,15.88 7.94,20.95 v7.94,25.72
  Bottom 0.406: v7.94,25.72 7.94,27.3 9.53,28.89 v9.53,29.53 | v14.61,8.26 8.89,8.26 6.99,6.35 v6.35,6.35 6.35,3.17 8.31,1.22 27.89,1.22 B1.5V
VIN  (via drill 0.35)
  Top 0.406: Q1.2 12.08,31.13 12.82,31.87 D1.C | C7.1 14.9,44.58 C6.1 12.55,41.29 D8.C D1.C | D1.C 13.65,36.83 14.92,38.1 19.05,38.1 19.53,37.62 U2.3 24.3,37.62 v25.08,36.83 | v31.11,16.51 31.11,25.02 30.1,26.04 28.57,26.04 27.62,26.99 v27.62,36.83 | v35.88,8.89 36.83,7.94 B1.VIN
  Bottom 0.406: v27.62,36.83 v25.08,36.83 | v35.88,8.89 35.88,13.65 33.02,16.51 v31.11,16.51